# EAGLE design Base_SMD (EAGLE 6.0)
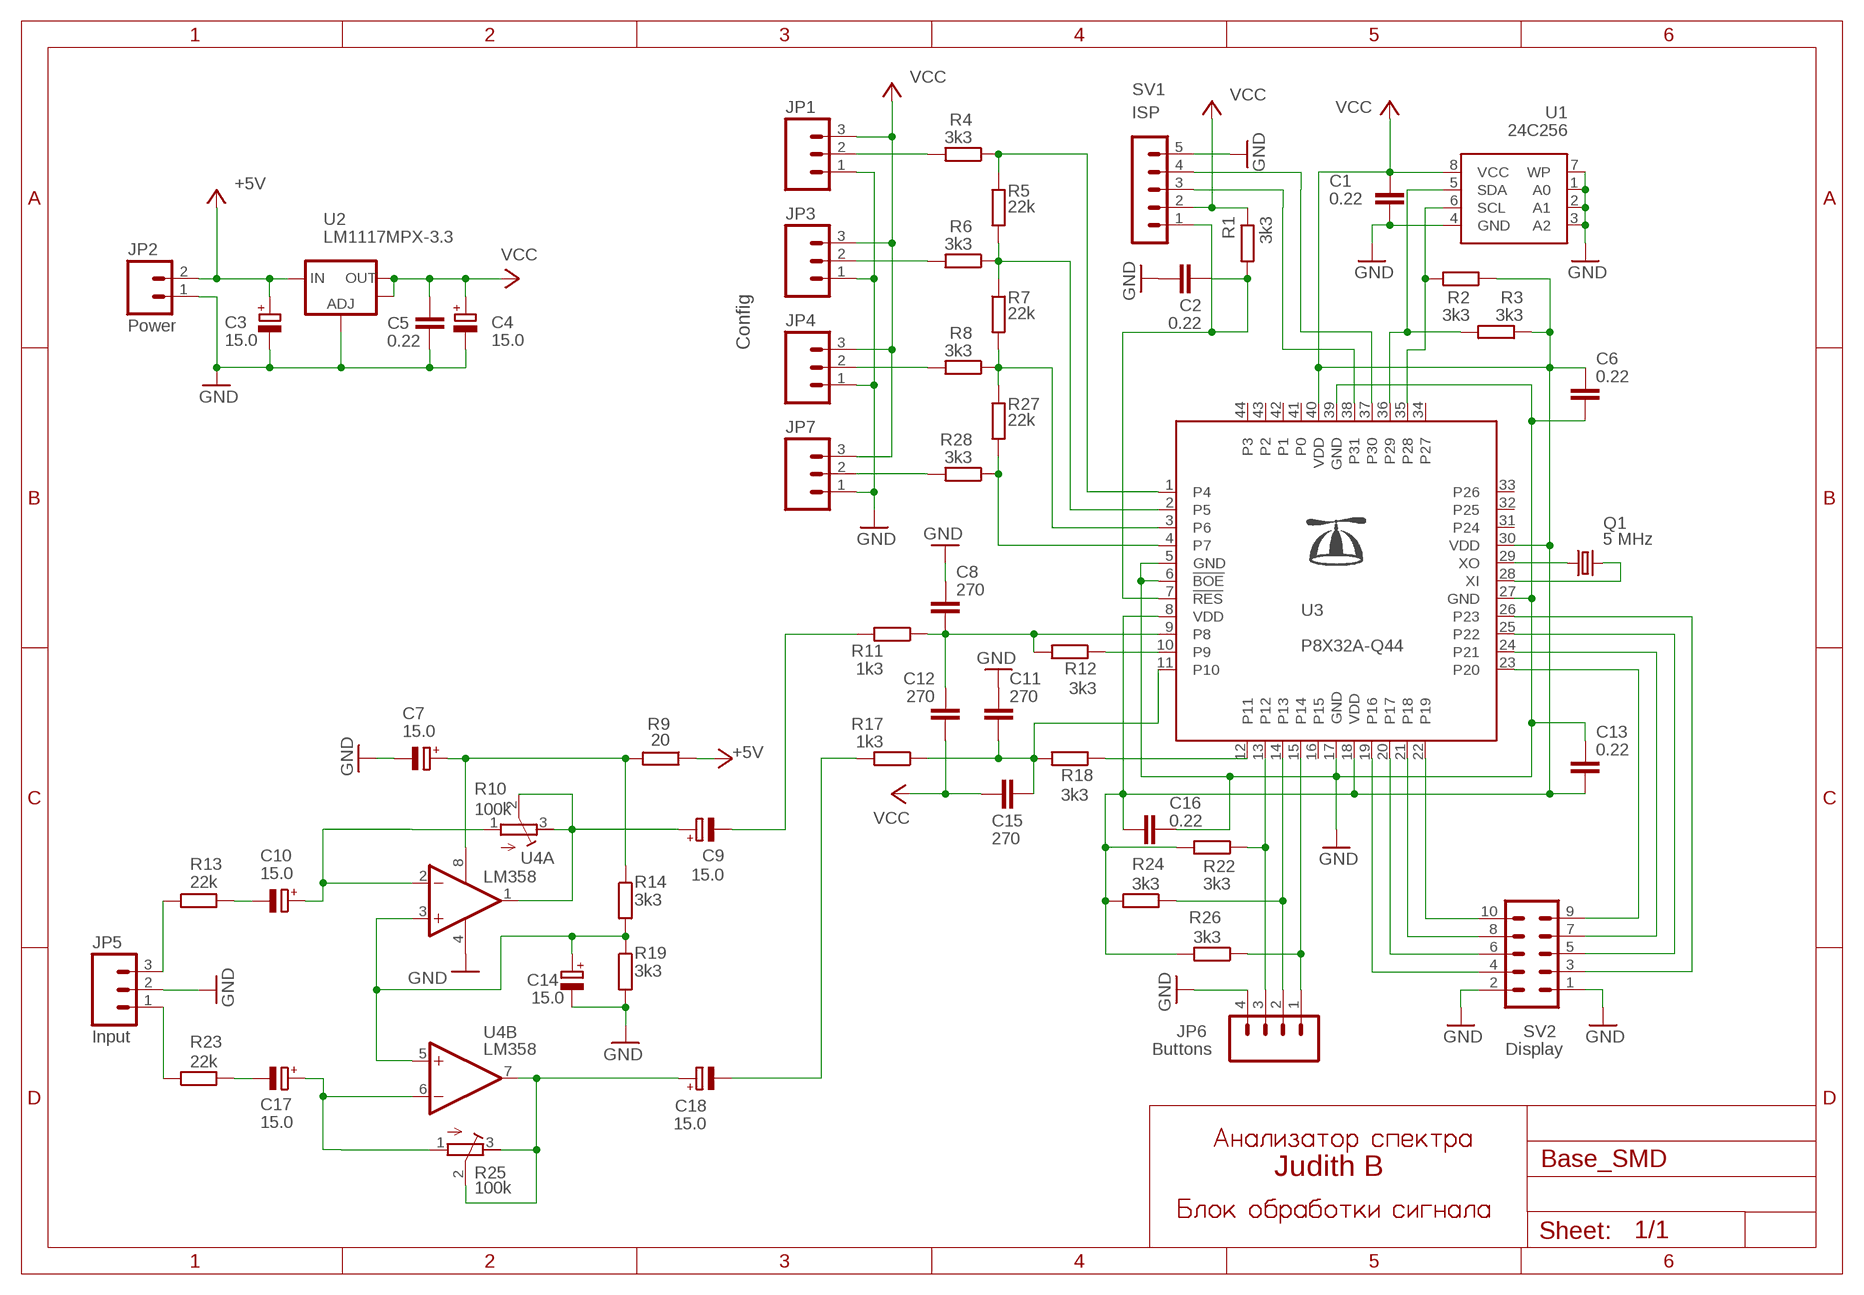
[diagram p0: schematic, sheet 1]

## Parts
C1  0.22  C-EUC0805  [C0805]
C2  0.22  C-EUC0805  [C0805]
C3  15.0  CPOL-EUSMCB  [SMC_B]
C4  15.0  CPOL-EUSMCB  [SMC_B]
C5  0.22  C-EUC0805  [C0805]
C6  0.22  C-EUC0805  [C0805]
C7  15.0  CPOL-EUSMCB  [SMC_B]
C8  270  C-EUC0805  [C0805]
C9  15.0  CPOL-EUSMCB  [SMC_B]
C10  15.0  CPOL-EUSMCB  [SMC_B]
C11  270  C-EUC0805  [C0805]
C12  270  C-EUC0805  [C0805]
C13  0.22  C-EUC0805  [C0805]
C14  15.0  CPOL-EUSMCB  [SMC_B]
C15  270  C-EUC0805  [C0805]
C16  0.22  C-EUC0805  [C0805]
C17  15.0  CPOL-EUSMCB  [SMC_B]
C18  15.0  CPOL-EUSMCB  [SMC_B]
JP1  M03PTH  [1X03]
JP2  Power  M02PTH  [1X02]
JP3  M03PTH  [1X03]
JP4  M03PTH  [1X03]
JP5  Input  M03PTH  [1X03]
JP6  Buttons  M04PTH  [1X04]
JP7  M03PTH  [1X03]
Q1  5 MHz  CRYSTALHC49S  [HC49/S]
R1  3k3  R-0805  [R0805]
R2  3k3  R-0805  [R0805]
R3  3k3  R-0805  [R0805]
R4  3k3  R-0805  [R0805]
R5  22k  R-0805  [R0805]
R6  3k3  R-0805  [R0805]
R7  22k  R-0805  [R0805]
R8  3k3  R-0805  [R0805]
R9  20  R-0805  [R0805]
R10  100k  R-TRIMM3296W  [RTRIM3296W]
R11  1k3  R-0805  [R0805]
R12  3k3  R-0805  [R0805]
R13  22k  R-0805  [R0805]
R14  3k3  R-0805  [R0805]
R17  1k3  R-0805  [R0805]
R18  3k3  R-0805  [R0805]
R19  3k3  R-0805  [R0805]
R22  3k3  R-0805  [R0805]
R23  22k  R-0805  [R0805]
R24  3k3  R-0805  [R0805]
R25  100k  R-TRIMM3296W  [RTRIM3296W]
R26  3k3  R-0805  [R0805]
R27  22k  R-0805  [R0805]
R28  3k3  R-0805  [R0805]
SV1  ISP  MA05-1  [MA05-1]
SV2  Display  MA05-2  [MA05-2]
U1  24C256  I2C_EEPROM  [SO08]
U2  LM1117MPX-3.3  V_REG_LM1117SOT223  [SOT223]
U3  P8X32A-Q44  [SQFP-S-10X10-44]
U4  LM358  TL072D  [SO08]

## Nets
+5V: C3.+ JP2.2 R9.1 U2.3(IN)
GND: C1.2 C2.1 C3.- C4.- C5.1 C6.2 C7.- C8.1 C11.1 C13.1 C14.- C16.2 JP1.1 JP2.1 JP3.1 JP4.1 JP5.2 JP6.4 JP7.1 R19.2 SV1.5 SV2.1 SV2.2 U1.1(A0) U1.2(A1) U1.3(A2) U1.4(GND) U1.7(WP) U2.1(ADJ) U3.5(GND) U3.6(!BOE) U3.17(GND) U3.27(GND) U3.39(GND) U4.4(P:V-)
N$1: C18.- R17.2
N$2: C9.- R11.2
N$3: Q1.2 U3.28(XI)
N$4: Q1.1 U3.29(XO)
N$5: C8.2 C12.2 R11.1 R12.2 U3.9(P8)
N$6: R12.1 U3.10(P9)
N$7: SV1.4 U3.37(P30)
N$8: SV1.3 U3.38(P31)
N$10: R2.2 U1.6(SCL) U3.35(P28)
N$12: C17.- R23.2
N$13: C10.- R13.2
N$14: C18.+ R25.2(S) R25.3(A) U4.7(B:OUT)
N$15: C9.+ R10.2(S) R10.3(A) U4.1(A:OUT)
N$16: R3.2 U1.5(SDA) U3.36(P29)
N$17: C11.2 C15.2 R17.1 R18.2 U3.11(P10)
N$18: JP5.1 R23.1
N$19: JP5.3 R13.1
N$20: C10.+ R10.1(E) U4.2(A:-IN)
N$21: R18.1 U3.12(P11)
N$22: C7.+ R9.2 R14.1 U4.8(P:V+)
N$23: JP6.1 R26.1 U3.15(P14)
N$24: JP6.2 R24.1 U3.14(P13)
N$25: JP6.3 R22.1 U3.13(P12)
N$26: R5.2 R6.1 R7.1 U3.2(P5)
N$27: SV2.4 U3.19(P16)
N$28: SV2.6 U3.20(P17)
N$29: SV2.8 U3.21(P18)
N$30: SV2.10 U3.22(P19)
N$31: SV2.9 U3.23(P20)
N$32: SV2.7 U3.24(P21)
N$33: SV2.5 U3.25(P22)
N$34: SV2.3 U3.26(P23)
N$35: R7.2 R8.1 R27.1 U3.3(P6)
N$36: R4.1 R5.1 U3.1(P4)
N$37: JP4.2 R8.2
N$38: JP3.2 R6.2
N$39: JP1.2 R4.2
N$40: C2.2 R1.2 SV1.1 U3.7(!RES)
N$41: C17.+ R25.1(E) U4.6(B:-IN)
N$42: R27.2 R28.1 U3.4(P7)
N$43: C14.+ R14.2 R19.1 U4.3(A:+IN) U4.5(B:+IN)
N$44: JP7.2 R28.2
VCC: C1.1 C4.+ C5.2 C6.1 C12.1 C13.2 C15.1 C16.1 JP1.3 JP3.3 JP4.3 JP7.3 R1.1 R2.1 R3.1 R22.2 R24.2 R26.2 SV1.2 U1.8(VCC) U2.2(OUT) U2.4(OUT) U3.8(VDD) U3.18(VDD) U3.30(VDD) U3.40(VDD)
Unconnected: U3.16(P15) U3.31(P24) U3.32(P25) U3.33(P26) U3.34(P27) U3.41(P0) U3.42(P1) U3.43(P2) U3.44(P3)

## Notes on the sheet
- Config
- Judith B

## Library data of the parts
C1 C2 C5 C6 C8 C11-C13 C15 C16 = my:C-EU: CAPACITOR, European symbol
C3 C4 C7 C9 C10 C14 C17 C18 = rcl:CPOL-EU: POLARIZED CAPACITOR, European symbol
JP1 JP3-JP5 JP7 = SparkFun:M03: Header 3 Standard 3-pin 0.1" header. Use with straight break away headers (SKU : PRT-00116), right angle break away headers (PRT-00553), swiss pins (PRT-00743), machine pins (PRT-00117), and female headers (PRT-00115). Molex polarized connector foot print use with SKU : PRT-08232 with associated crimp pins and housings.
JP2 = SparkFun:M02: Header 2 Standard 2-pin 0.1" header. Use with straight break away headers (SKU : PRT-00116), right angle break away headers (PRT-00553), swiss pins (PRT-00743), machine pins (PRT-00117), and female headers (PRT-00115). Molex polarized connector foot print use with SKU : PRT-08233 with associated crimp pins and housings.
JP6 = SparkFun:M04: Header 4 Standard 4-pin 0.1" header. Use with straight break away headers (SKU : PRT-00116), right angle break away headers (PRT-00553), swiss pins (PRT-00743), machine pins (PRT-00117), and female headers (PRT-00115). Molex polarized connector foot print use with SKU : PRT-08231 with associated crimp pins and housings.
Q1 = crystal:CRYSTAL: CRYSTAL
R1-R9 R11-R14 R17-R19 R22-R24 R26-R28 = my:R
R10 R25 = rcl:R-TRIMM: Trimm resistor
SV1 = con-lstb:MA05-1: PIN HEADER
SV2 = con-lstb:MA05-2: PIN HEADER
U1 = my:I2C_EEPROM
U2 = SparkFun:V_REG_LM1117: Voltage Regulator LM1117 Standard adjustable voltage regulator but in SMD form. Spark Fun Electronics SKU : COM-00595
U3 = my:P8X32A-Q44
U4 = linear:TL072: OP AMP

## Board
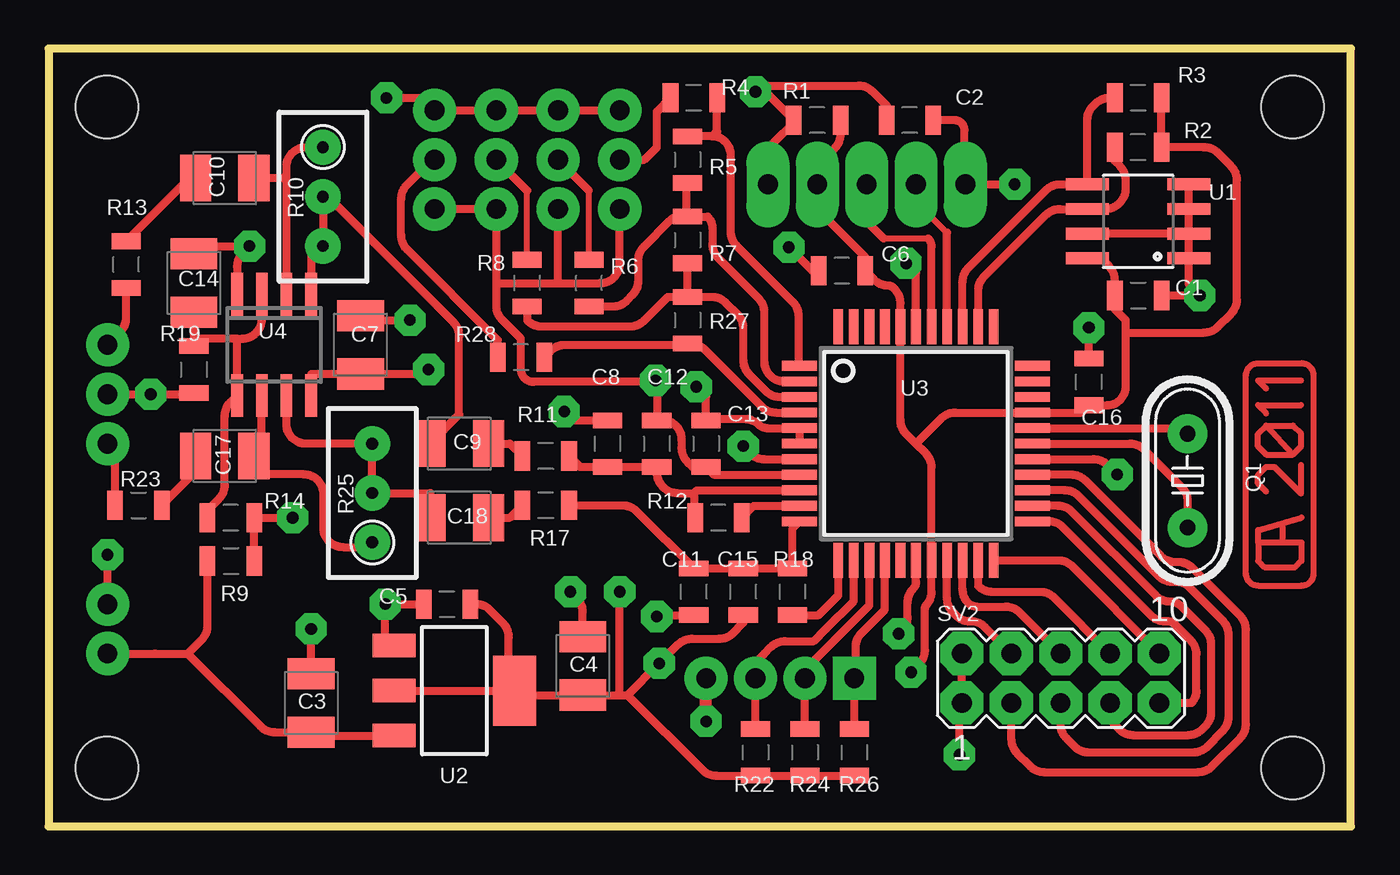
[diagram p1: board, top side]
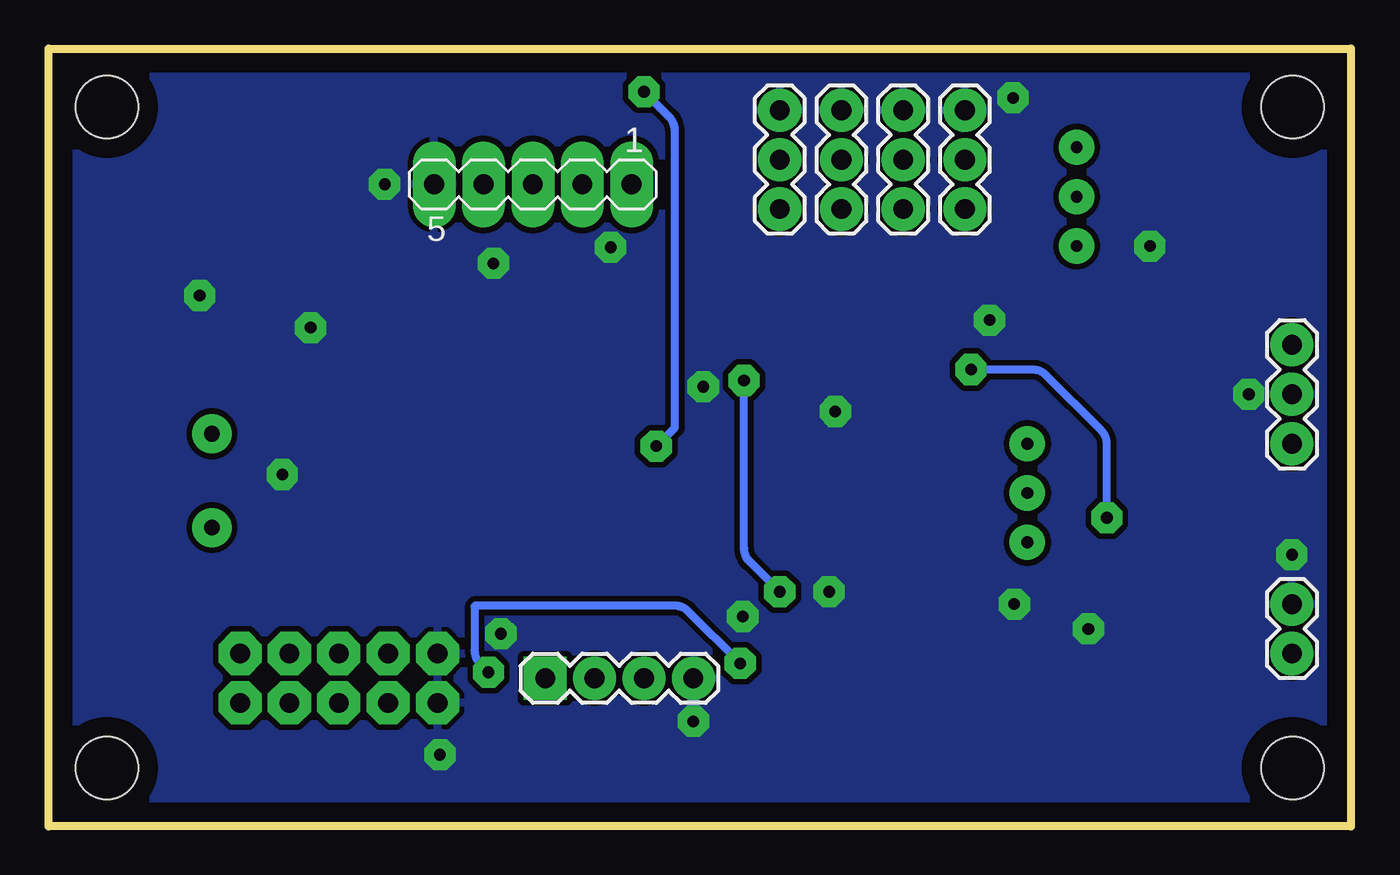
[diagram p2: board, bottom side, seen from below]

Size 67 x 40 mm. Coordinates in mm from the lower left corner, seen from the top.
Outline: 0,0 67,0 67,40 0,40 0,0
Copper layers (1*16): Top 0.035mm / dielectric 1.5mm / Bottom 0.035mm
Design rules: minimum track width 10mil, minimum drill 0.5mm, track to track 0.3mm, track to pad 0.3mm, pad to pad 0.3mm, via to via 0.3mm, smd to smd 0.3mm, copper to edge 40mil, drill to drill 8mil, minimum pad ring 0.6mm, minimum via ring 0.5mm, stop-mask expansion 4mil, vias tented up to drill 0mil, thermal gap 10mil
Holes 3.2 mm at 3,3 3,37 64,37 64,3

### Footprints (pad centres in the part's own frame; a part is rotated, then mirrored left to right if it is on the bottom)
C0805 = smd 0.8 x 1.5: 1 -1.2,0; 2 1.2,0
SMC_B = smd 1.6 x 2.4: + -1.5,0; - 1.5,0
1X03 = drill 1.016 pad 1.88: 1 0,0; 2 2.54,0; 3 5.08,0
1X02 = drill 1.016 pad 1.88: 1 0,0; 2 2.54,0
1X04 = drill 1.016 pad 1.88 square: 1 0,0 | drill 1.016 pad 1.88: 2 2.54,0; 3 5.08,0; 4 7.62,0
HC49/S = drill 0.813: 1 -2.413,0; 2 2.413,0
R0805 = smd 0.8 x 1.5: 1 -1.2,0; 2 1.2,0
RTRIM3296W = drill 0.61: 1 0,-2.54; 2 0,0; 3 0,2.54
MA05-1 = drill 1.016 long: 1 -5.08,0; 2 -2.54,0; 3 0,0; 4 2.54,0; 5 5.08,0
MA05-2 = drill 1.016 octagon: 1 -5.08,-1.27; 2 -5.08,1.27; 3 -2.54,-1.27; 4 -2.54,1.27; 5 0,-1.27; 6 0,1.27; 7 2.54,-1.27; 8 2.54,1.27; 9 5.08,-1.27; 10 5.08,1.27
SO08 = smd 0.61 x 2.21: 1 -1.905,-2.616; 2 -0.635,-2.616; 3 0.635,-2.616; 4 1.905,-2.616; 5 1.905,2.616; 6 0.635,2.616; 7 -0.635,2.616; 8 -1.905,2.616
SOT223 = smd 1.219 x 2.235: 1 -2.311,-3.099; 2 0,-3.099; 3 2.311,-3.099 | smd 3.6 x 2.2: 4 0,3.099
SQFP-S-10X10-44 = smd 0.5 x 1.8: 1 -4,-6; 2 -3.2,-6; 3 -2.4,-6; 4 -1.6,-6; 5 -0.8,-6; 6 0,-6; 7 0.8,-6; 8 1.6,-6; 9 2.4,-6; 10 3.2,-6; 11 4,-6; 23 4,6; 24 3.2,6; 25 2.4,6; 26 1.6,6; 27 0.8,6; 28 0,6; 29 -0.8,6; 30 -1.6,6; 31 -2.4,6; 32 -3.2,6; 33 -4,6 | smd 1.8 x 0.5: 12 6,-4; 13 6,-3.2; 14 6,-2.4; 15 6,-1.6; 16 6,-0.8; 17 6,0; 18 6,0.8; 19 6,1.6; 20 6,2.4; 21 6,3.2; 22 6,4; 34 -6,4; 35 -6,3.2; 36 -6,2.4; 37 -6,1.6; 38 -6,0.8; 39 -6,0; 40 -6,-0.8; 41 -6,-1.6; 42 -6,-2.4; 43 -6,-3.2; 44 -6,-4
SO08' = smd 0.6 x 2.2: 1 -1.905,-2.6; 2 -0.635,-2.6; 3 0.635,-2.6; 4 1.905,-2.6; 5 1.905,2.6; 6 0.635,2.6; 7 -0.635,2.6; 8 -1.905,2.6

### Placement (x,y rotation side)
C1  56.05,27.3 0 top
C2  44.31,36.32 180 top
C3  13.51,6.35 90 top
C4  27.48,8.26 90 top
C5  20.5,11.43 0 top
C6  40.81,28.57 180 top
C7  16.05,24.77 90 top
C8  28.75,19.68 270 top
C9  21.13,19.68 0 top
C10  9.06,33.34 180 top
C11  33.2,12.06 90 top
C12  31.29,19.68 270 top
C13  33.83,19.68 270 top
C14  7.48,27.94 90 top
C15  35.73,12.06 90 top
C16  53.52,22.86 90 top
C17  9.06,19.05 180 top
C18  21.13,15.88 0 top
JP1  29.39,36.83 270 bottom
JP2  3.03,11.43 270 bottom
JP3  26.21,36.83 270 bottom
JP4  23.04,36.83 270 bottom
JP5  3.03,19.68 90 bottom
JP6  41.45,7.62 0 bottom
JP7  19.86,36.83 270 bottom
Q1  58.59,17.78 270 top
R1  39.55,36.32 180 top
R2  56.05,34.92 180 top
R3  56.05,37.47 180 top
R4  33.2,37.47 180 top
R5  32.88,34.29 270 top
R6  27.8,27.94 90 top
R7  32.88,30.16 270 top
R8  24.62,27.94 90 top
R9  9.38,13.65 0 top
R10  14.11,32.38 180 top
R11  25.57,19.05 180 top
R12  34.47,15.88 180 top
R13  3.98,28.89 90 top
R14  9.38,15.88 180 top
R17  25.57,16.51 180 top
R18  38.27,12.06 90 top
R19  7.48,23.5 270 top
R22  36.37,3.81 270 top
R23  4.62,16.51 0 top
R24  38.91,3.81 270 top
R25  16.65,17.14 0 top
R26  41.45,3.81 270 top
R27  32.88,26.04 270 top
R28  24.3,24.13 180 top
SV1  42.09,33.02 180 bottom
SV2  52.07,7.62 0 top
U1  56.05,31.11 90 top
U2  20.88,6.99 270 top
U3  44.62,19.68 270 top
U4  LM358  [SO08']  11.61,24.77 180 top

### Tracks (layer width: path | path; a pad name or v marks a point on that pad's centre or on a via)
+5V
  Top 0.406: U2.3 13.69,4.67 C3.+ 11.61,4.85 arc-45 10.91,5.14 7.16,8.89 | JP2.2 3.17,8.89 5.46,8.89 7.16,8.89 | 7.16,8.89 7.89,9.62 arc45 8.18,10.33 R9.1
GND  (via drill 0.6)
  Top 0.406: U3.27 53.77,18.89 arc-45 54.48,18.59 v54.98,18.1 | C11.1 31.36,10.87 v31.29,10.79 | U3.6 U3.5 36.96,20.48 arc-45 36.54,20.66 arc45 35.83,20.95 33.9,20.95 C13.1 33.83,22.1 v33.32,22.61 | U2.1 17.32,9.75 v17.32,11.43 C5.1 | C16.2 v53.52,25.65 | U1.4 U1.3 U1.2 | C4.- 27.48,11.02 arc45 27.19,11.72 v26.84,12.06 | C7.- 16.05,26.04 v18.59,26.04 | JP5.2 v5.25,22.23 7.41,22.23 R19.2 | v49.7,33.02 SV1.5 47.12,33.07 47.12,35.81 arc90 46.61,36.32 C2.1 | JP1.1 JP3.1 JP4.1 JP7.1 19.23,37.47 v17.38,37.47 | C3.- v13.51,10.16 | JP2.1 v3.03,13.97 | U3.39 44.62,28.45 v44.12,28.96 | U1.2 U1.7 | U1.2 U1.1 58.67,27.86 v59.23,27.3 C1.2 | C8.1 26.98,20.89 v26.53,21.34 | 39.55,28.57 C6.2 39.29,28.57 v38.08,29.78 | U4.4 9.7,28.8 arc-45 9.99,29.5 v10.34,29.84 7.88,29.84 C14.- | U3.17 44.62,12.56 arc-45 44.49,12.23 arc45 44.2,11.52 44.2,10.78 arc-45 43.9,10.07 v43.74,9.91 | v46.86,3.68 46.86,6.22 SV2.1 SV2.2
  Top 0.61: v33.83,5.4 33.83,7.48 33.97,7.62
  Bottom 0.61: v33.83,5.4 33.83,7.45 33.66,7.62
  pour Bottom: 0,0 67.56,0 67.56,40 0,40
N$1
  Top 0.406: R17.2 23.74,15.88 C18.-
N$2
  Top 0.406: R11.2 23.74,19.68 C9.-
N$3
  Top 0.406: U3.28 55.64,19.68 arc-45 56.35,19.39 58.3,17.44 arc-45 58.59,16.73 Q1.2
N$4
  Top 0.406: U3.29 58.3,20.48 Q1.1
N$5
  Top 0.406: U3.9 33.34,17.29 33.2,17.14 | 33.2,17.14 33.2,15.95 R12.2 | R11.1 27.34,18.48 C8.2 C12.2 31.29,18.19 arc45 31.58,17.49 31.63,17.44 arc45 32.34,17.14 33.2,17.14
N$6
  Top 0.406: U3.10 36.27,16.48 R12.1
N$7
  Top 0.308: 46.23,30.53 44.62,32.13
  Top 0.406: U3.37 46.23,30.53 | 44.62,32.13 SV1.4
N$8
  Top 0.308: 45.26,30.23 42.97,30.23
  Top 0.406: U3.38 45.42,29.83 arc45 45.26,30.23 | 42.97,30.23 42.09,31.11 SV1.3
N$9
  Top 0.305: 62.23,14.61 63.5,14.61 | 63.5,14.61 64.45,14.61 64.45,13.65 64.14,13.34 62.55,13.34 62.23,13.65 62.23,14.61 | 62.23,14.61 62.23,15.24 64.45,15.88 | 63.5,14.61 63.5,15.56
N$10
  Top 0.406: U3.35 47.83,27.55 arc-45 48.12,28.26 51.32,31.46 arc-45 52.02,31.75 U1.6 54.37,31.75 arc45 55.08,32.04 55.13,32.09 arc45 55.42,32.8 55.42,33.24 arc45 55.13,33.95 54.85,34.22 R2.2
N$11
  Top 0.305: 62.23,12.38 arc-90 61.59,13.02 61.59,23.18 arc-90 62.23,23.81 64.45,23.81 arc-90 65.09,23.18 65.09,13.02 arc-90 64.45,12.38 62.23,12.38
N$12
  Top 0.406: R23.2 7.57,18.25 C17.-
N$13
  Top 0.406: R13.2 7.23,33.34 C10.-
N$14
  Top 0.406: C18.+ 19.63,17.14 R25.2 R25.3 13.24,19.68 arc-90 12.24,20.68 U4.7
N$15
  Top 0.406: U4.1 13.51,29.84 R10.3 R10.2 14.38,32.38 20.84,25.92 arc-45 21.13,25.22 21.13,21.18 C9.+
N$16
  Top 0.406: U3.36 47.02,28.02 arc-45 47.32,28.73 51.32,32.73 arc-45 52.02,33.02 U1.5 53.44,36.34 arc-45 53.73,37.05 53.86,37.17 arc-45 54.56,37.47 R3.2
N$17
  Top 0.406: U3.11 38.27,15.34 R18.2 C15.2 C11.2 30.24,16.22 arc45 29.54,16.51 R17.1
N$18
  Top 0.406: R23.1 3.42,18.88 arc45 3.13,19.59 JP5.1
N$19
  Top 0.406: JP5.3 3.69,25.43 arc45 3.98,26.13 R13.1
N$20
  Top 0.406: U4.2 12.24,33.34 | 12.24,33.34 12.24,33.92 arc-90 13.24,34.92 R10.1 | 12.24,33.34 C10.+
N$21
  Top 0.406: R18.1 39.62,10.87 40.62,11.88 U3.12
N$22  (via drill 0.6)
  Top 0.406: U4.8 13.51,23.27 C7.+ 19.31,23.27 v19.54,23.5 | R9.2 R14.1 v12.56,15.88
  Bottom 0.406: v12.56,15.88 12.56,19.66 arc-45 12.85,20.36 15.69,23.2 arc-45 16.39,23.5 v19.54,23.5
N$23
  Top 0.406: R26.1 JP6.1 41.53,7.7 41.53,9.24 arc-45 41.82,9.95 43.02,11.15 U3.15
N$24
  Top 0.406: R24.1 JP6.2 38.91,7.63 arc-45 39.2,8.34 40.26,9.4 42.23,11.36 U3.14
N$25
  Top 0.406: R22.1 JP6.3 36.37,8.02 arc-45 36.66,8.72 36.83,8.89 37.17,9.23 arc-45 37.88,9.53 39.37,9.53 40.01,10.16 41.42,11.58 U3.13
N$26
  Top 0.406: U3.2 37.84,22.89 arc-45 37.13,23.18 37.11,23.2 arc-45 36.81,23.91 36.81,26.45 arc45 36.52,27.15 34.44,29.23 arc-45 34.15,29.94 34.15,30.77 arc45 33.9,31.36 R7.1 32.81,31.43 | R6.1 29.04,26.74 arc45 29.75,27.03 30.05,27.33 arc45 30.34,28.04 30.34,29.11 arc-45 30.63,29.82 31.95,31.14 arc-45 32.66,31.43 32.81,31.43 | 32.81,31.43 32.81,33.02 R5.2
N$27
  Top 0.406: U3.19 46.23,11.72 arc45 46.52,11.01 46.7,10.83 arc45 47.4,10.54 47.47,10.54 arc-45 48.17,10.25 SV2.4
N$28
  Top 0.406: U3.20 47.02,12.19 arc45 47.32,11.48 arc45 47.75,11.3 49.24,11.3 arc-45 49.95,11.01 SV2.6
N$29
  Top 0.406: U3.21 47.83,12.39 arc45 47.84,12.36 arc45 48.55,12.06 51.02,12.06 arc-45 51.73,11.77 SV2.8
N$30
  Top 0.406: U3.22 51.94,13.69 arc-45 52.65,13.39 SV2.10
N$31
  Top 0.406: SV2.9 58.8,6.35 arc45 59.05,6.96 59.05,8.86 arc45 58.76,9.56 57.91,10.41 arc45 57.6,10.54 57.44,10.54 arc-45 56.73,10.83 52.96,14.61 52.17,15.39 arc45 51.47,15.69 U3.23
N$32
  Top 0.406: U3.24 51.94,16.48 arc-45 52.64,16.19 56.98,11.85 arc45 57.69,11.56 arc-45 58.28,11.31 59.52,10.07 arc-45 59.82,9.37 59.82,5.88 arc-45 59.52,5.17 59.35,4.99 arc-45 58.64,4.7 55.79,4.7 arc-45 55.08,4.99 54.9,5.17 arc-45 54.61,5.88 SV2.7
N$33
  Top 0.406: U3.25 52.28,17.29 arc-45 52.98,16.99 57.11,12.87 arc45 57.82,12.57 58.01,12.57 arc-45 58.71,12.28 60.41,10.58 arc-45 60.71,9.87 60.71,5.62 arc-45 60.41,4.91 59.6,4.1 arc-45 58.9,3.81 53.5,3.81 arc-45 52.79,4.1 52.36,4.53 arc-45 52.07,5.24 SV2.5
N$34
  Top 0.406: U3.26 52.62,18.09 arc-45 53.33,17.79 54.1,17.02 57.24,13.88 arc45 57.95,13.59 58.13,13.59 arc-45 58.84,13.3 61.3,10.83 arc-45 61.59,10.13 61.59,5.24 arc-45 61.3,4.53 59.86,3.09 arc-45 59.15,2.79 51.21,2.79 arc-45 50.51,3.09 49.82,3.77 arc-45 49.53,4.48 SV2.3
N$35
  Top 0.406: U3.3 37.62,22.09 arc-45 36.92,22.38 36.03,23.27 arc-45 35.73,23.97 35.73,25.62 arc45 35.44,26.33 34.83,26.94 arc45 34.12,27.23 R27.1 | R8.1 24.62,26.07 arc45 24.65,26.01 arc45 25.35,25.72 29.92,25.72 arc45 30.63,26.01 31.86,27.23 R27.1 | R27.1 R7.2
N$36
  Top 0.406: 34.15,35.49 R5.1 | 34.15,35.49 34.15,35.49 arc-45 34.81,35.22 arc-45 35.1,34.51 35.1,30.58 arc45 35.39,29.87 38.3,26.96 arc-45 38.59,26.26 38.59,23.72 U3.1 | R4.1 34.4,35.74 34.15,35.49
N$37
  Top 0.308: R8.2 24.62,32.7
  Top 0.406: 24.62,32.7 JP4.2
N$38
  Top 0.308: R6.2 27.8,32.7
  Top 0.406: 27.8,32.7 JP3.2
N$39
  Top 0.406: JP1.2 30.66,34.29 31.29,34.92 31.29,36.76 R4.2
N$40  (via drill 0.6)
  Top 0.406: v35.73,19.56 36.12,19.18 arc45 36.82,18.89 U3.7 | v36.37,37.78 36.76,37.78 | C2.2 43.11,37.08 42.38,37.81 arc45 41.67,38.1 36.69,38.1 v36.37,37.78 | SV1.1 37.01,34.44 arc-45 37.3,35.15 38.34,36.2 R1.2 36.88,37.78 v36.37,37.78
  Bottom 0.406: v35.73,19.56 34.78,20.51 34.78,35.78 arc-45 35.08,36.49 v36.37,37.78
N$41
  Top 0.406: U4.6 10.97,19.05 C17.+ 10.56,18.1 13.14,18.1 arc-90 14.14,17.1 14.14,15.36 arc90 15.14,14.36 16.44,14.36 16.65,14.57 R25.1
N$42
  Top 0.406: U3.4 37.41,21.29 arc-45 36.7,21.58 33.73,24.54 arc45 33.03,24.84 R27.2 32.81,24.77 26.55,24.77 arc45 25.85,24.47 R28.1
N$43
  Top 0.406: 9.7,25.08 U4.5 9.36,21.82 arc45 9.06,21.12 9.06,17.56 arc-45 8.77,16.85 8.18,16.26 R14.2 | 9.7,25.08 9.97,25.08 arc90 10.97,26.08 U4.3 | C14.+ R19.1 7.87,25.08 9.7,25.08
N$44
  Top 0.406: R28.2 23.11,25.01 18.44,29.68 arc-45 18.14,30.39 18.14,32.29 arc-45 18.44,32.99 19.73,34.29 JP7.2
N$45
  Top 0.305: 62.64,17.22 62.22,17.64 62.22,18.07 62.64,18.49 63.07,18.49 64.44,17.11 64.44,18.59
N$46
  Top 0.305: 62.64,20.61 62.22,20.18 62.22,19.55 62.64,19.12 64.02,19.12 | 62.64,20.61 64.02,20.61 64.44,20.18 64.44,19.55 64.02,19.12 | 64.02,19.12 62.64,20.61
N$47
  Top 0.305: 62.64,21.24 62.22,21.66 64.44,21.66
N$48
  Top 0.305: 62.64,22.51 62.22,22.93 64.44,22.93
VCC  (via drill 0.6)
  Top 0.406: 44.62,19.68 45.93,20.99 arc-45 46.64,21.29 U3.30 53.14,21.29 C16.1 54.47,21.66 arc45 55.13,21.93 arc45 55.42,22.64 55.42,25.4 | 44.62,19.68 44.12,20.19 arc-45 43.83,20.9 U3.40 43.83,26.93 arc45 43.53,27.64 43.47,27.7 arc45 43.19,27.81 arc-45 42.48,28.11 C6.1 42.02,29.28 39.55,31.75 SV1.2 39.55,33.97 40.45,34.88 arc45 40.74,35.59 R1.1 | 44.62,19.68 45.13,19.18 arc-45 45.42,18.47 U3.18 45.42,12.06 arc-45 45.13,11.35 arc45 45.09,11.24 45.09,9.05 arc-45 44.79,8.35 v44.37,7.92 | U2.2 U2.4 | C5.2 21.99,11.43 arc-45 22.69,11.14 23.38,10.45 arc-45 23.67,9.75 23.67,7.29 U2.4 | U2.4 24.2,6.75 C4.+ 29.39,6.75 | U3.8 34.23,18.09 C13.2 33.12,18.48 32.85,18.76 arc-45 32.56,19.46 32.56,19.91 arc45 32.27,20.61 arc45 31.61,20.89 C12.1 31.29,22.86 v31.22,22.93 31.15,22.86 24.94,22.86 arc-90 24.3,23.5 24.3,25.08 23.33,26.06 arc-45 23.04,26.77 23.04,27.94 | 23.04,27.94 JP4.3 JP7.3 | 23.04,27.94 26.21,27.94 | 26.21,27.94 28.39,27.94 arc90 29.39,28.94 JP1.3 | 26.21,27.94 JP3.3 | R26.2 R24.2 R22.2 34.35,2.61 arc-45 33.64,2.9 29.79,6.75 | 29.39,6.75 v29.39,12.06 | 55.42,25.4 55.42,26.04 54.85,26.6 C1.1 54.85,28.09 arc45 54.56,28.8 54.15,29.21 U1.8 | 55.42,25.4 59.45,25.4 arc45 60.16,25.69 60.84,26.38 arc45 61.13,27.08 61.13,33.24 arc45 60.84,33.95 60.16,34.63 arc45 59.45,34.92 R2.1 R3.1 | C15.1 35.73,10.46 35.22,9.95 arc-45 34.51,9.65 33.1,9.65 arc45 32.39,9.36 v31.42,8.38 29.79,6.75 | 29.39,6.75 29.79,6.75
  Bottom 0.406: v29.39,12.06 30.93,13.61 arc45 31.22,14.31 v31.22,22.93 | v44.37,7.92 44.79,8.35 arc45 45.09,9.05 45.09,11.3 45.03,11.35 35.66,11.35 34.8,11.35 arc45 34.1,11.06 v31.42,8.38

### Text on the board
Measures: 67 | 3.2 | 34 | 40 | 61